# EasyEDA Pro project 无刷双驱.epro, schematic Schematic1

## Sheets
1 Control: Board Name: PCB1; Create Date: 2025-07-03; Page Name: Control; Project Name: 无刷双驱2.0; Schematic Name: Schematic1; Update Date: 2025-07-03; Company: 嘉立创EDA; Page Size: A4; Version: V1.0
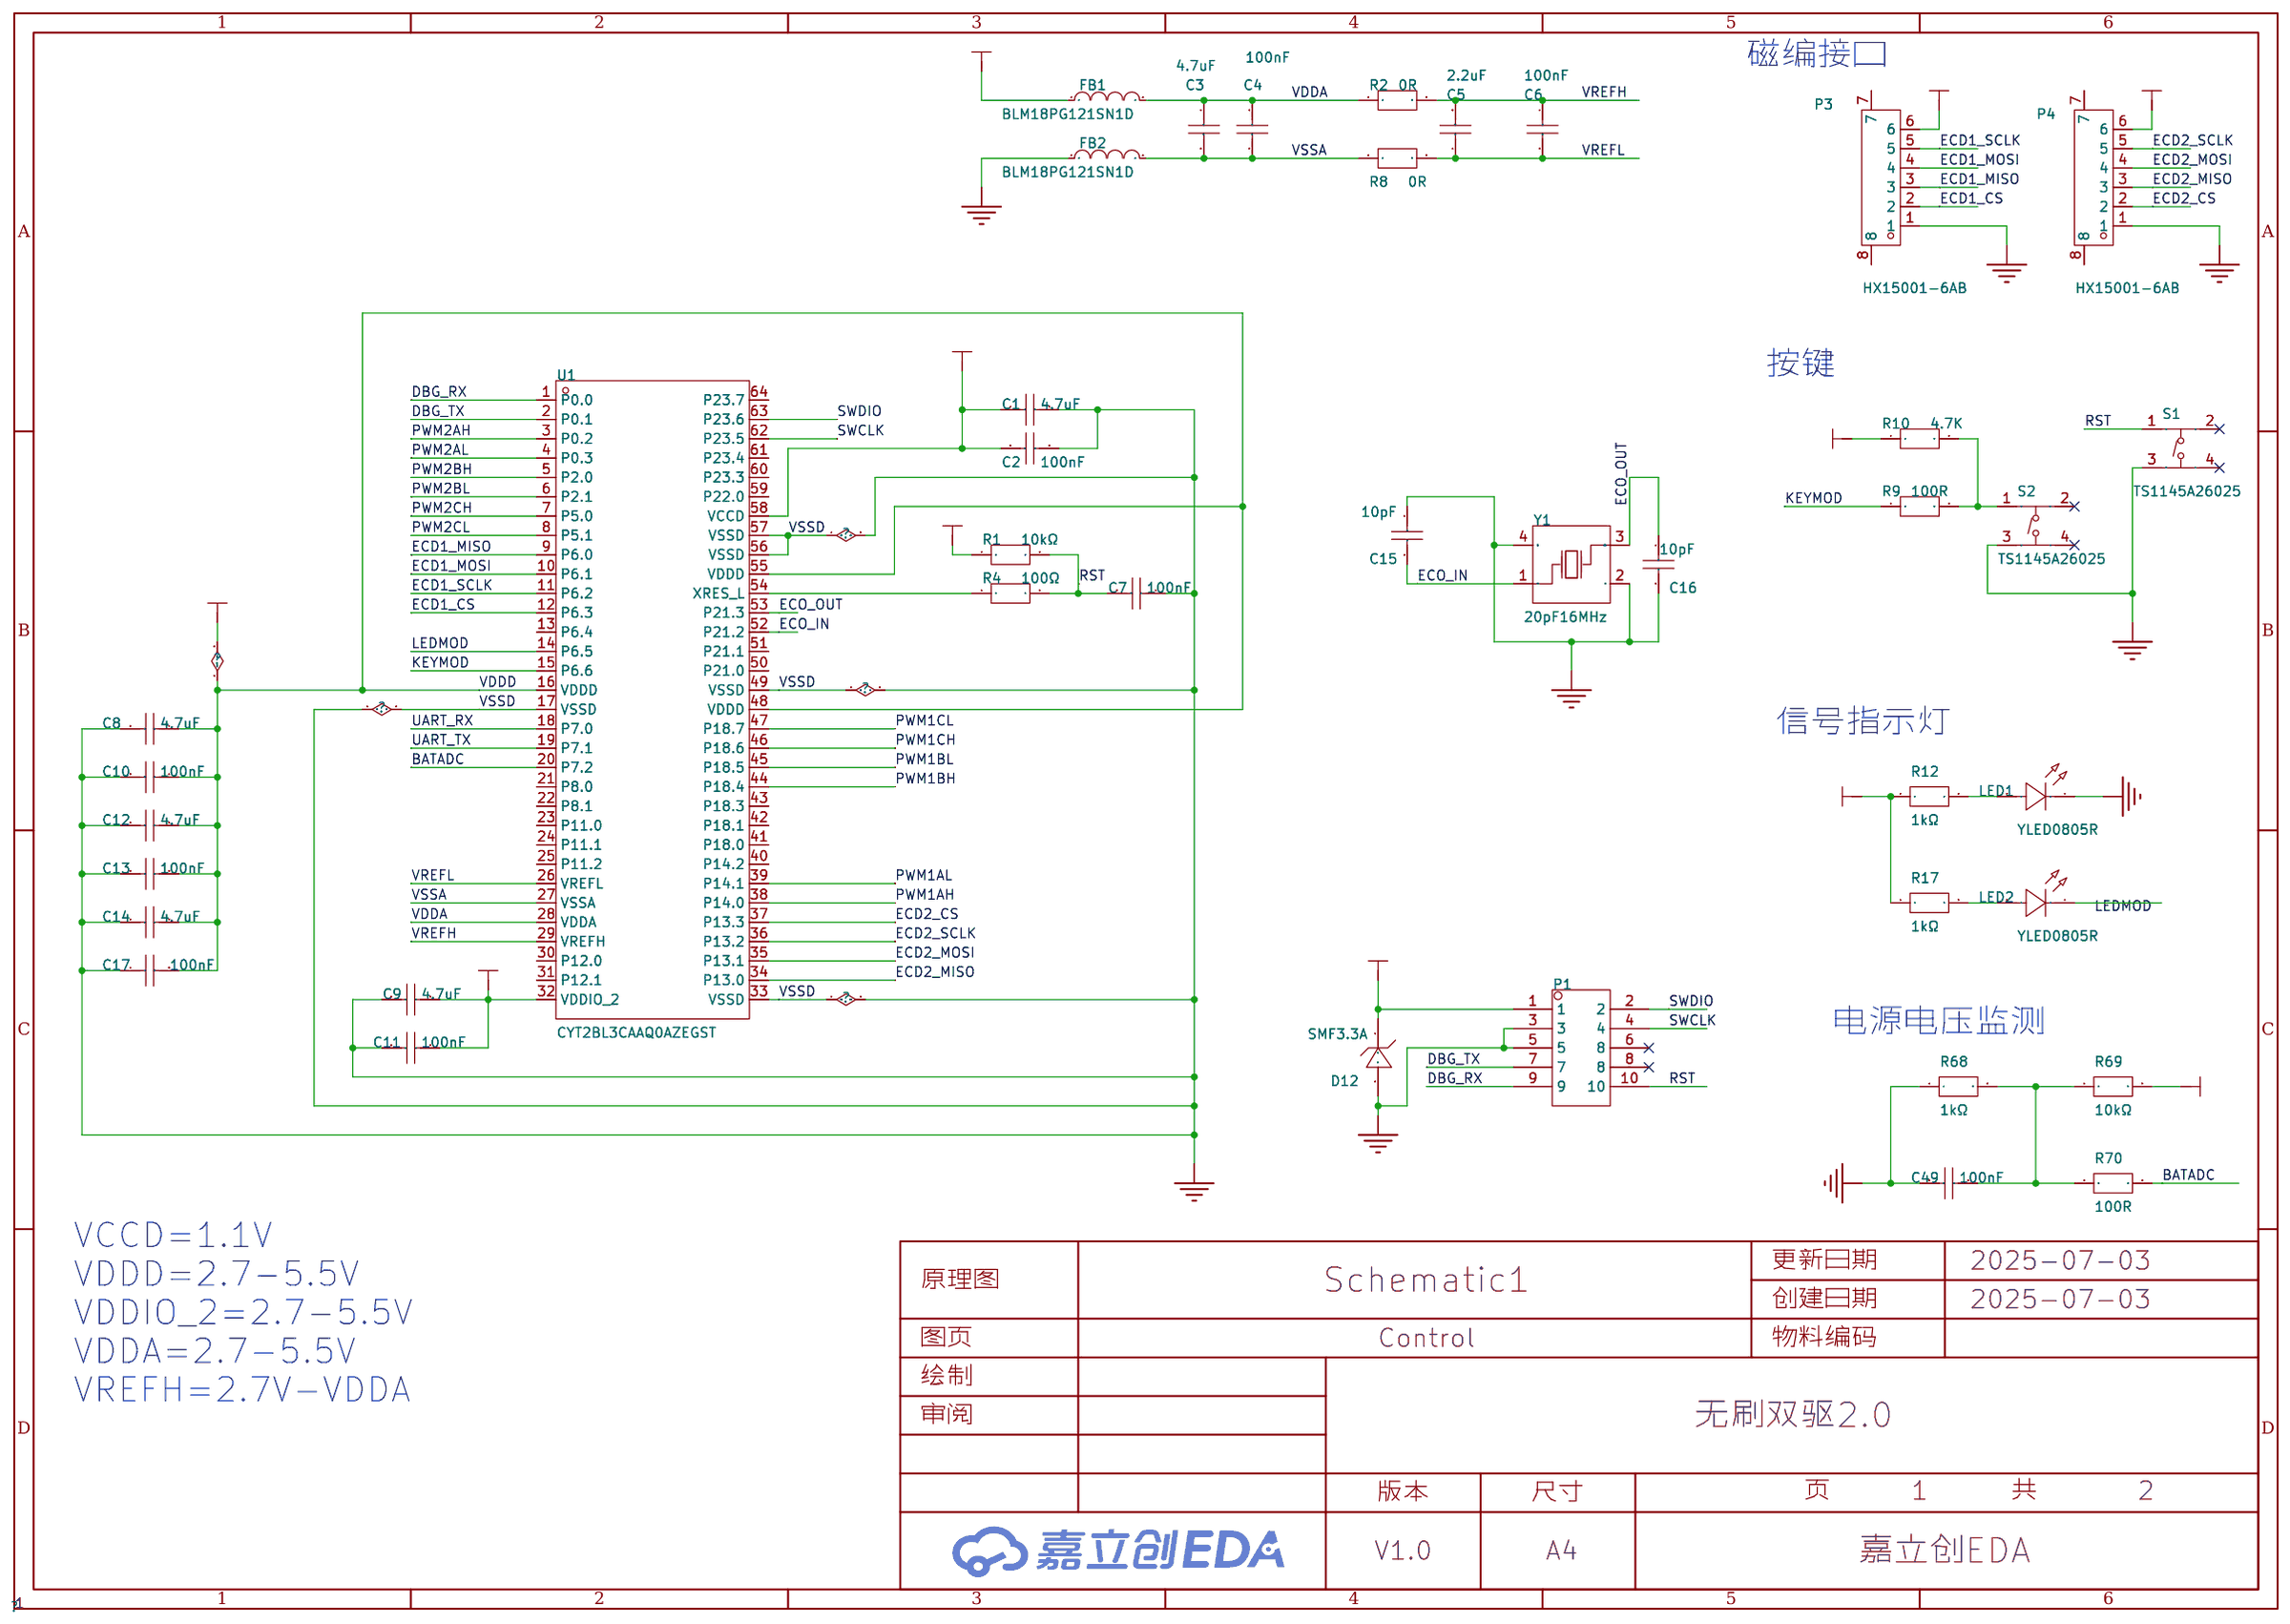
[diagram p0: Control]
2 Power: Page Name: Power; Project Name: FOC
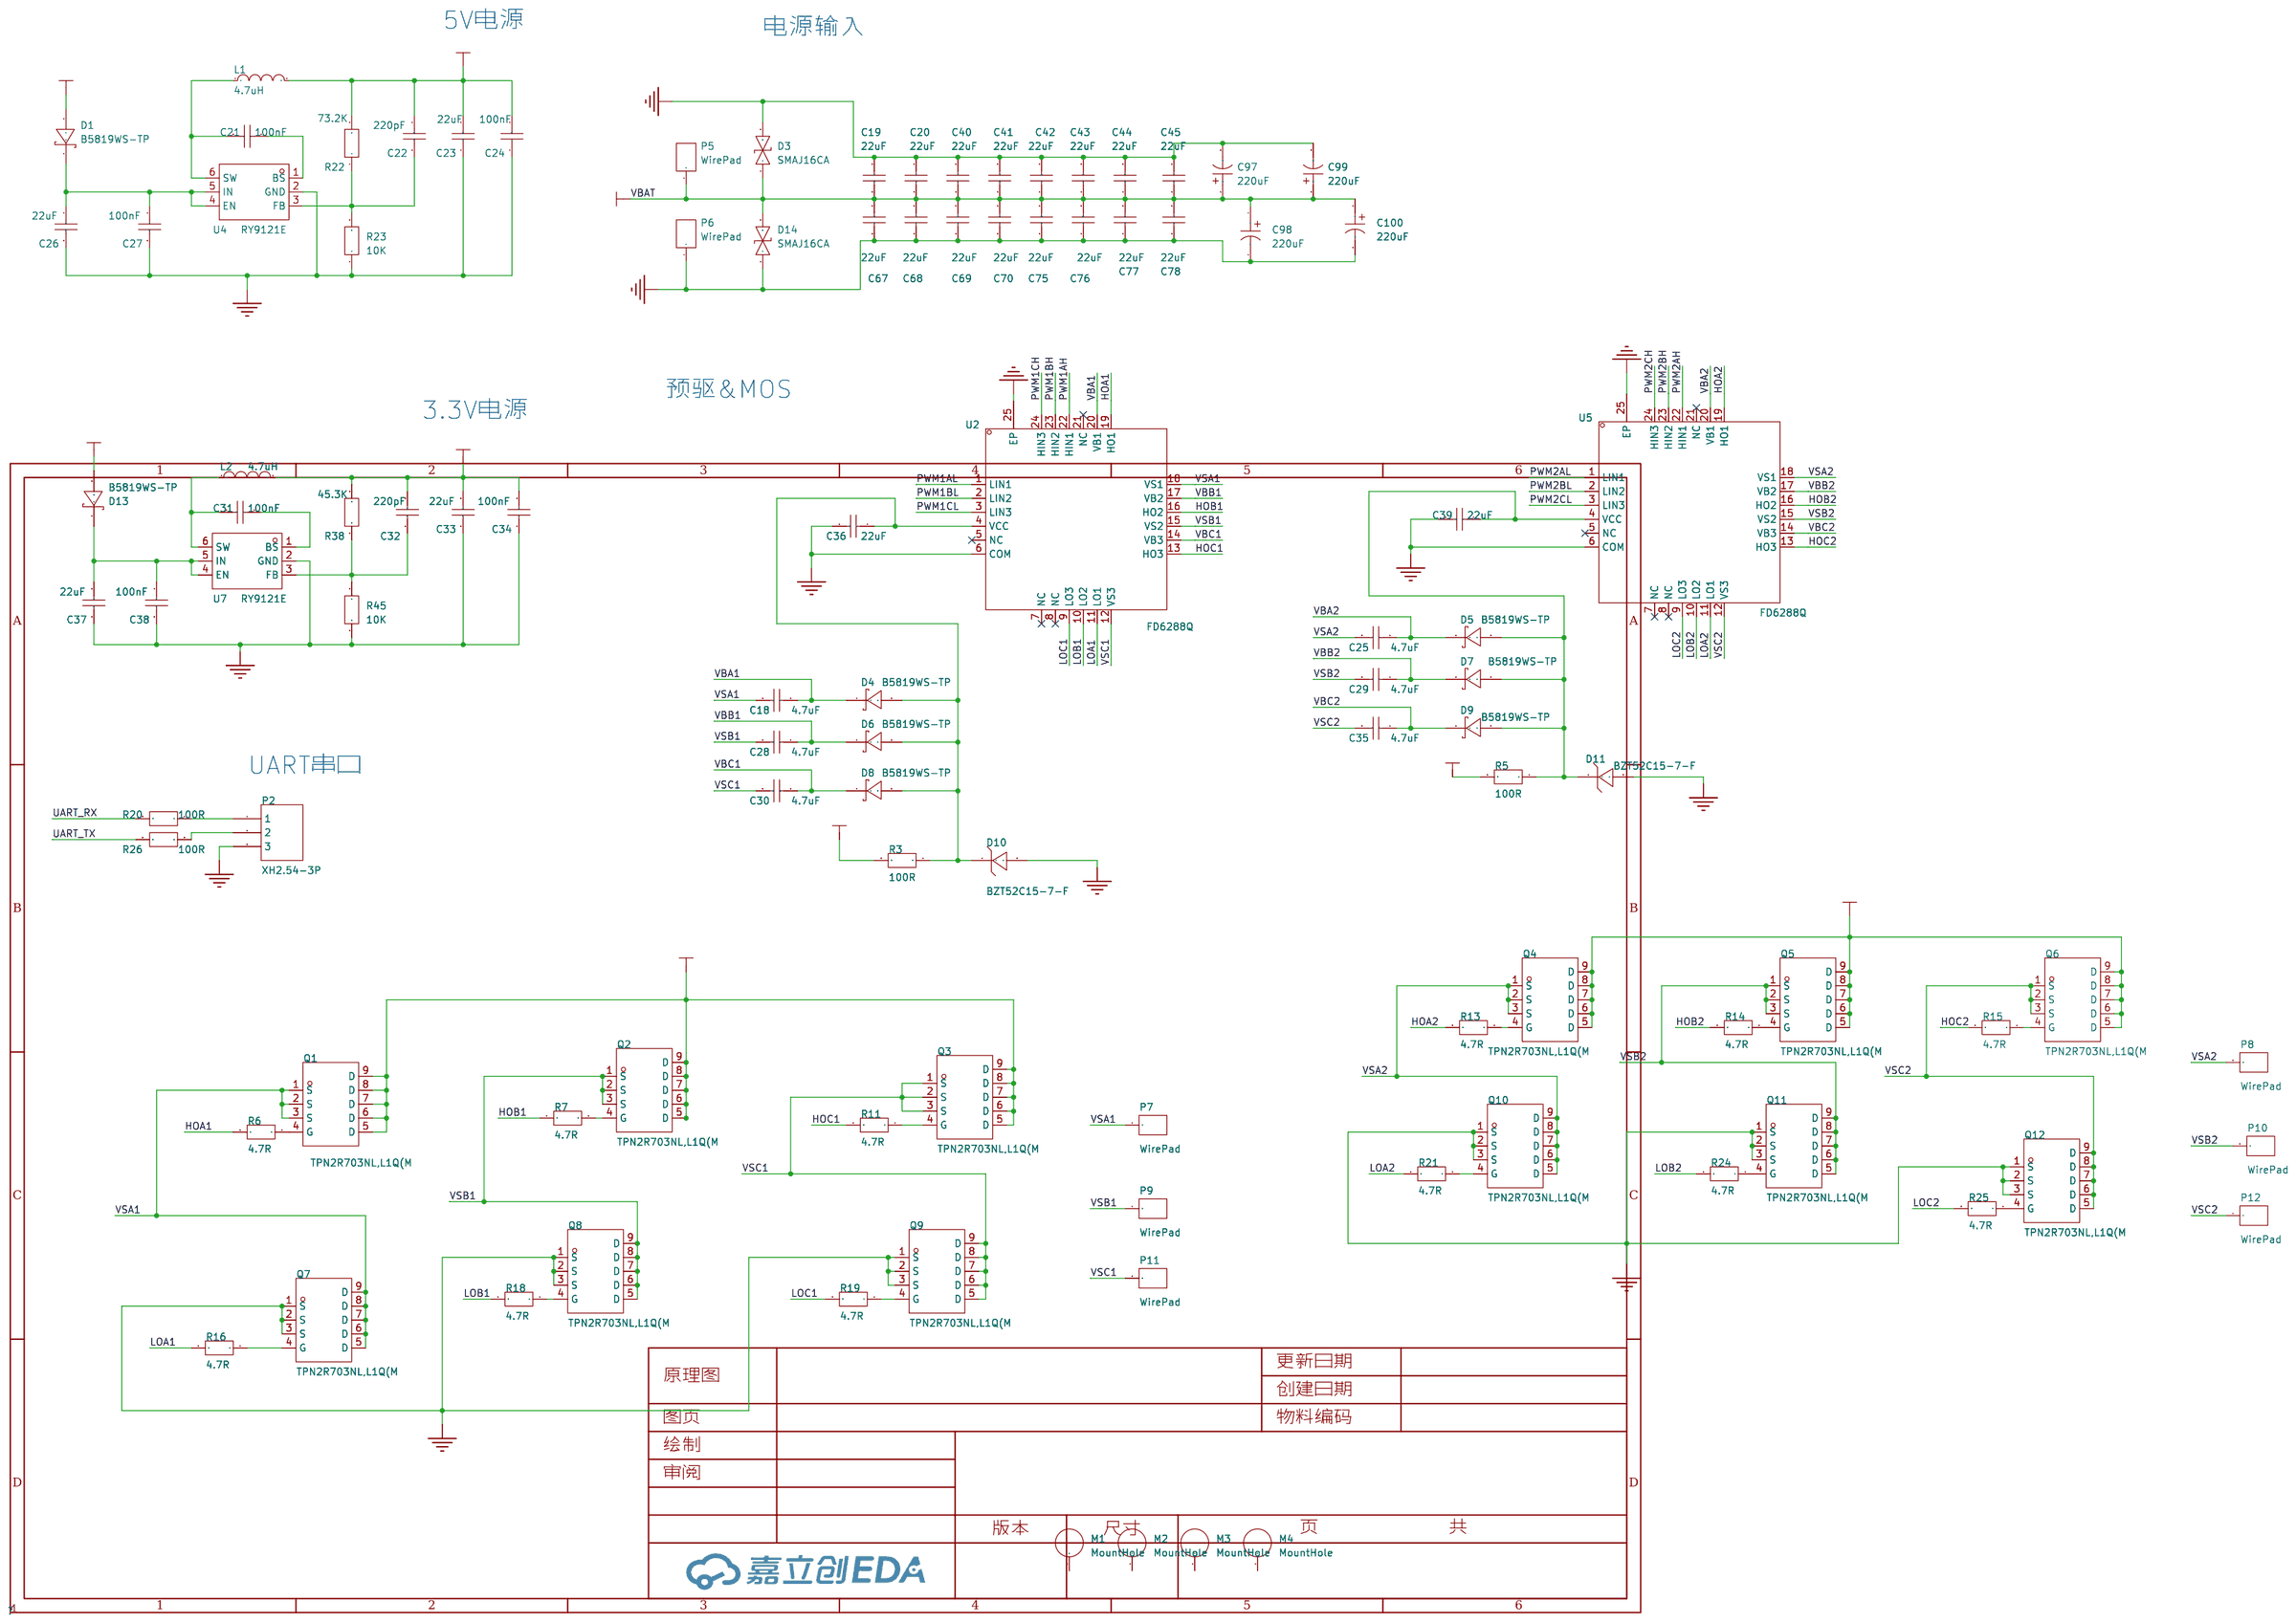
[diagram p1: Power]

## Parts
sheet Control
C1  4.7uF  [C0603]
C2  100nF  [C0603]
C3  4.7uF  [C0603]
C4  100nF  [C0603]
C5  2.2uF  [C0603]
C6  100nF  [C0603]
C7  100nF  [C0603]
C8  4.7uF  [C0603]
C9  4.7uF  [C0603]
C10  100nF  [C0603]
C11  100nF  [C0603]
C12  4.7uF  [C0603]
C13  100nF  [C0603]
C14  4.7uF  [C0603]
C15  10pF  [C0603]
C16  10pF  [C0603]
C17  100nF  [C0603]
C49  100nF  [C0603]
D12  SMF3.3A  [SOD-123_L2.8-W1.8-LS3.7-RD]
FB1  BLM18PG121SN1D  [L0603]
FB2  BLM18PG121SN1D  [L0603]
LED1  YLED0805R  [LED0805-RD]
LED2  YLED0805R  [LED0805-RD]
P1  -  [HDR-M-2.54-2x5-DS]
P3  HX15001-6AB  [CONN-SMD_HX15001-6AB]
P4  HX15001-6AB  [CONN-SMD_HX15001-6AB]
R1  10kΩ  [R0603]
R2  0R  [R0603]
R4  100Ω  [R0603]
R8  0R  [R0603]
R9  100R  [R0603]
R10  4.7K  [R0603]
R12  1kΩ  [R0603]
R17  1kΩ  [R0603]
R68  1kΩ  [R0603]
R69  10kΩ  [R0603]
R70  100R  [R0603]
S1  TS1145A26025  [SW-SMD_4P-L4.2-W3.2-P2.15-LS4.6]
S2  TS1145A26025  [SW-SMD_4P-L4.2-W3.2-P2.15-LS4.6]
U1  CYT2BL3CAAQ0AZEGST  [LQFP-64_L10.0-W10.0-P0.50-LS12.0-BL]
Y1  20pF16MHz  [CRYSTAL-SMD_4P-L3.2-W2.5-BL]
sheet Power
C18  4.7uF  [C0603]
C19  22uF  [C0603]
C20  22uF  [C0603]
C21  100nF  [C0603]
C22  220pF  [C0603]
C23  22uF  [C0603]
C24  100nF  [C0603]
C25  4.7uF  [C0603]
C26  22uF  [C0603]
C27  100nF  [C0603]
C28  4.7uF  [C0603]
C29  4.7uF  [C0603]
C30  4.7uF  [C0603]
C31  100nF  [C0603]
C32  220pF  [C0603]
C33  22uF  [C0603]
C34  100nF  [C0603]
C35  4.7uF  [C0603]
C36  22uF  [C0603]
C37  22uF  [C0603]
C38  100nF  [C0603]
C39  22uF  [C0603]
C40  22uF  [C0603]
C41  22uF  [C0603]
C42  22uF  [C0603]
C43  22uF  [C0603]
C44  22uF  [C0603]
C45  22uF  [C0603]
C67  22uF  [C0603]
C68  22uF  [C0603]
C69  22uF  [C0603]
C70  22uF  [C0603]
C75  22uF  [C0603]
C76  22uF  [C0603]
C77  22uF  [C0603]
C78  22uF  [C0603]
C97  220uF  [CAP-TH_BD6.3-P2.50-D1.0-FD]
C98  220uF  [CAP-TH_BD6.3-P2.50-D1.0-FD]
C99  220uF  [CAP-TH_BD6.3-P2.50-D1.0-FD]
C100  220uF  [CAP-TH_BD6.3-P2.50-D1.0-FD]
D1  B5819WS-TP  [SOD-323_L1.8-W1.3-LS2.5-RD]
D3  SMAJ16CA  [SMA_L4.4-W2.6-LS5.0-BI]
D4  B5819WS-TP  [SOD-323_L1.8-W1.3-LS2.5-RD]
D5  B5819WS-TP  [SOD-323_L1.8-W1.3-LS2.5-RD]
D6  B5819WS-TP  [SOD-323_L1.8-W1.3-LS2.5-RD]
D7  B5819WS-TP  [SOD-323_L1.8-W1.3-LS2.5-RD]
D8  B5819WS-TP  [SOD-323_L1.8-W1.3-LS2.5-RD]
D9  B5819WS-TP  [SOD-323_L1.8-W1.3-LS2.5-RD]
D10  BZT52C15-7-F  [SOD-123F_L2.8-W1.8-LS3.7-RD]
D11  BZT52C15-7-F  [SOD-123F_L2.8-W1.8-LS3.7-RD]
D13  B5819WS-TP  [SOD-323_L1.8-W1.3-LS2.5-RD]
D14  SMAJ16CA  [SMA_L4.4-W2.6-LS5.0-BI]
L1  4.7uH  [IND-SMD_L2.5-W2.0_YXMBL252010P]
L2  4.7uH  [IND-SMD_L2.5-W2.0_YXMBL252010P]
M1  MountHole  [M3-MountHole-Plated]
M2  MountHole  [M3-MountHole-Plated]
M3  MountHole  [M3-MountHole-Plated]
M4  MountHole  [M3-MountHole-Plated]
P2  XH2.54-3P  [XH2.54-3P-SH]
P5  WirePad  [WirePad-4x6]
P6  WirePad  [WirePad-4x6]
P7  WirePad  [WirePad-4x6]
P8  WirePad  [WirePad-4x6]
P9  WirePad  [WirePad-4x6]
P10  WirePad  [WirePad-4x6]
P11  WirePad  [WirePad-4x6]
P12  WirePad  [WirePad-4x6]
Q1  TPN2R703NL,L1Q(M  [TSON-8_L3.1-W3.1-P0.65-LS3.3-BL-EP]
Q2  TPN2R703NL,L1Q(M  [TSON-8_L3.1-W3.1-P0.65-LS3.3-BL-EP]
Q3  TPN2R703NL,L1Q(M  [TSON-8_L3.1-W3.1-P0.65-LS3.3-BL-EP]
Q4  TPN2R703NL,L1Q(M  [TSON-8_L3.1-W3.1-P0.65-LS3.3-BL-EP]
Q5  TPN2R703NL,L1Q(M  [TSON-8_L3.1-W3.1-P0.65-LS3.3-BL-EP]
Q6  TPN2R703NL,L1Q(M  [TSON-8_L3.1-W3.1-P0.65-LS3.3-BL-EP]
Q7  TPN2R703NL,L1Q(M  [TSON-8_L3.1-W3.1-P0.65-LS3.3-BL-EP]
Q8  TPN2R703NL,L1Q(M  [TSON-8_L3.1-W3.1-P0.65-LS3.3-BL-EP]
Q9  TPN2R703NL,L1Q(M  [TSON-8_L3.1-W3.1-P0.65-LS3.3-BL-EP]
Q10  TPN2R703NL,L1Q(M  [TSON-8_L3.1-W3.1-P0.65-LS3.3-BL-EP]
Q11  TPN2R703NL,L1Q(M  [TSON-8_L3.1-W3.1-P0.65-LS3.3-BL-EP]
Q12  TPN2R703NL,L1Q(M  [TSON-8_L3.1-W3.1-P0.65-LS3.3-BL-EP]
R3  100R  [R0603]
R5  100R  [R0603]
R6  4.7R  [R0603]
R7  4.7R  [R0603]
R11  4.7R  [R0603]
R13  4.7R  [R0603]
R14  4.7R  [R0603]
R15  4.7R  [R0603]
R16  4.7R  [R0603]
R18  4.7R  [R0603]
R19  4.7R  [R0603]
R20  100R  [R0603]
R21  4.7R  [R0603]
R22  73.2K  [R0603]
R23  10K  [R0603]
R24  4.7R  [R0603]
R25  4.7R  [R0603]
R26  100R  [R0603]
R38  45.3K  [R0603]
R45  10K  [R0603]
U2  FD6288Q  [QFN-24_L4.0-W4.0-P0.50-BL-EP2.6]
U4  RY9121E  [SOT-23-6_L2.9-W1.6-P0.95-LS2.8-BL]
U5  FD6288Q  [QFN-24_L4.0-W4.0-P0.50-BL-EP2.6]
U7  RY9121E  [SOT-23-6_L2.9-W1.6-P0.95-LS2.8-BL]

## Library data of the parts
C1-C45 C49 C67-C70 C75-C78 = CL10A475KO8NNNC: 容值:4.7uF;精度:±10%;额定电压:16V;材质(温度系数):X5R;; LCSC Part Name: 4.7uF ±10% 16V; Supplier Part: C19666; Manufacturer: SAMSUNG(三星); Supplier Footprint: 0603; JLCPCB Part Class: 基础库; Datasheet: https://atta.szlcsc.com/upload/public/pdf/source/20160218/1457707763339.pdf; Supplier: LCSC; Tolerance: ±10%; Voltage Rated: 16V; Temperature Coefficient: X5R
D12 = SMF3.3A_C283866: 反向截止电压(Vrwm):3.3V;最大钳位电压:8V;峰值脉冲电流(Ipp)@10/1000us:25A;击穿电压:5.2V;; Supplier Part: C283866; Manufacturer: DOWO(东沃); Supplier Footprint: SOD-123FL; JLCPCB Part Class: 扩展库; Datasheet: https://atta.szlcsc.com/upload/public/pdf/source/20240321/1BA336232F2D97E4B026619682DB80D3.pdf; Supplier: LCSC; Reverse Stand-Off Voltage (Vrwm): 3.3V; Maximum Clamping Voltage: 8V; Peak Pulse Current (Ipp)@10/1000us: 25A; Breakdown Voltage: 5.2V; Reverse Leakage Current (Ir): 600uA; Type: TVS
FB1 FB2 = BLM18PG121SN1D: 标称阻抗@测试频率:120Ω@100MHz;误差:±25%;直流电阻(RDC):50mΩ;; LCSC Part Name: 单路 0603磁珠 阻抗120Ω@100MHz; Supplier Part: C14709; Manufacturer: muRata(村田); Supplier Footprint: 0603; JLCPCB Part Class: 扩展库; Datasheet: https://atta.szlcsc.com/upload/public/pdf/source/20130704/1457706621422.pdf; Supplier: LCSC; Impedance @ Frequency: 120Ω@100MHz; Tolerance: ±25%; DC Resistance: 50mΩ; Current Rating: 2A; Circuits: 1
LED1 LED2 = YLED0805R: 发光颜色:红色;正向电压(VF):1.8V~2.4V;功率:60mW;正向电流:20mA;主波长:615nm~630nm;二极管配置:-;透镜颜色:-;色温:-;发光强度:-;发光角度:-;载带方式:-;工作温度:-40℃~+85℃;; Supplier Part: C19171391; Manufacturer: YONGYUTAI(永裕泰); Supplier Footprint: 0805; JLCPCB Part Class: 扩展库; Datasheet: https://atta.szlcsc.com/upload/public/pdf/source/20231027/AB486D22E6D71BC59190C48A798367E6.pdf; Supplier: LCSC; Emitted Color: 红色; Forward Voltage (VF): 1.8V~2.4V; Power Dissipation: 60mW; Forward Current: 20mA; Dominant Wavelength: 615nm~630nm; Peak Wavelength: 645nm; Operating Temperature: -40℃~+85℃
P1 = hdr-m-2.54-2x5-ds: 插脚排针用于夹板贴片使用，2x5，间距2.54mm
P3 P4 = HX15001-6AB: 插针结构:1x6P;间距:1.5mm;安装方式:立贴;参考系列:-;总PIN数:6P;排数:1;每排PIN数:6;行距:-;额定电流:1A;工作温度范围:-25℃~+85℃;; LCSC Part Name: 1x6P 间距:1.5mm 立贴 配套：HX15000-6Y; Supplier Part: C442142; Manufacturer: HX(红星); Supplier Footprint: SMD,P=1.5mm; JLCPCB Part Class: 扩展库; Datasheet: https://atta.szlcsc.com/upload/public/pdf/source/20200415/C442142_C06F0DDFBB95EC3947D2DC5802394DE5.pdf; Supplier: LCSC; Pins Structure: 1x6P; Pitch: 1.5mm; Mounting Style: 立贴; Number of Pins: 6P; Number of Rows: 1; Number of PINs Per Row: 6; Current Rating (Max): 1A; Operating Temperature Range: -25℃~+85℃
R1-R26 R38 R45 R68-R70 = FRC0603J103TS: 电阻类型:厚膜电阻;阻值:10kΩ;精度:±5%;功率:100mW;最大工作电压:75V;温度系数:±100ppm/℃;; LCSC Part Name: 10kΩ ±5% 100mW 厚膜电阻; Supplier Part: C2930027; Manufacturer: FOJAN(富捷); Supplier Footprint: 0603; JLCPCB Part Class: 扩展库; Datasheet: https://atta.szlcsc.com/upload/public/pdf/source/20211221/925EC7D7225764EE0046F22065062C87.pdf; Supplier: LCSC; Type: 厚膜电阻; Tolerance: ±5%; Power(Watts): 100mW; Overload Voltage (Max): 75V; Temperature Coefficient: ±100ppm/℃; Operating Temperature Range: -55℃~+155℃
S1 S2 = TS1145A26025: Supplier Part: C22375315; Manufacturer: HanElectricity(瀚源); Supplier Footprint: SMD-4P,4.2x3.2mm; JLCPCB Part Class: 扩展库; Datasheet: https://atta.szlcsc.com/upload/public/pdf/source/20240426/BE19A9ACDD8195A867E04CF99141E744.pdf; Supplier: LCSC
U1 = CYT2BL3CAAQ0AZEGST: CPU内核:ARM-M4；ARM-M0+;CPU最大主频:100MHz；160MHz;应用领域:-;; Supplier Part: C6814187; Manufacturer: Infineon(英飞凌); Supplier Footprint: LQFP-64(10x10); JLCPCB Part Class: Extended Part; Datasheet: https://atta.szlcsc.com/upload/public/pdf/source/20241028/9C5F45A22757023D6821BF2A2597B3D9.pdf; Supplier: LCSC; CPU Core: ARM-M4；ARM-M0+; CPU Maximum Speed: 100MHz；160MHz; Number of I/O: 49; ADC (Bit): 12bit; Low Voltage Detection Threshold: 2.7V~5.5V
Y1 = TAXM16M4RLBCCT2T: 晶振类型:贴片晶振;频率:16MHz;常温频差:±10ppm;负载电容:20pF;频率稳定度(全温):±15ppm;; LCSC Part Name: 16MHz ±10ppm 20pF; Supplier Part: C164049; Manufacturer: YJX(雅晶鑫); Supplier Footprint: SMD3225-4P; JLCPCB Part Class: 扩展库; Datasheet: https://atta.szlcsc.com/upload/public/pdf/source/20200713/C164049_7D9D040C2FDFEE55E99A1CB38C95A19D.pdf; Supplier: LCSC; Crystal Type: 贴片晶振; Normal temperature Frequency Tolerance: ±10ppm; Load Capacitor: 20pF; Frequency Stability(Full temperature range): ±15ppm; Equivalent Series Resistance (ESR): 40Ω; Operating Temperature: -40℃~+85℃
C97-C100 = 25YXJ220M6.3X11: 容值:220uF;精度:±20%;额定电压:25V;纹波电流:400mA@100kHz;等效串联电阻:220mΩ@100kHz;; LCSC Part Name: 220uF ±20% 25V; Supplier Part: C88729; Manufacturer: rubycon(红宝石); Supplier Footprint: 插件,D6.3xL11mm; JLCPCB Part Class: Extended Part; Datasheet: https://atta.szlcsc.com/upload/public/pdf/source/20190927/C432444_D90212164DBC1B856ABE912664018FD4.pdf; Supplier: LCSC; Tolerance: ±20%; Rated Voltage: 25V; Ripple Current: 400mA@100kHz; Equivalent Series Resistance(ESR): 220mΩ@100kHz; Lead Spacing: 2.5mm; φD: 6.3mm; L: 11mm; Lifetime @ Temp: 7000hrs@105℃
D1 D4-D9 D13 = B5819WS-TP: 正向压降(Vf):600mV@1A;直流反向耐压(Vr):40V;平均整流电流(Io):1A;; LCSC Part Name: 电压:40V 电流:1A; Supplier Part: C78734; Manufacturer: MCC(美微科); Supplier Footprint: SOD-323; JLCPCB Part Class: 扩展库; Datasheet: https://atta.szlcsc.com/upload/public/pdf/source/20190308/C78734_7BD7F562D63F05C7B4187010ADA330AA.pdf; Supplier: LCSC; Forward Voltage (Vf@If): 600mV@1A; Reverse Voltage (Vr): 40V; Average Rectified Current (Io): 1A; Reverse Leakage Current (Ir): 1mA@40V
D3 D14 = SMAJ16CA_C148217: 反向截止电压(Vrwm):16V;最大钳位电压:26V;峰值脉冲电流(Ipp)@10/1000us:15.4A;峰值脉冲功率(Ppp)@10/1000us:400W;击穿电压:17.8V;; LCSC Part Name: 双向TVS 16V截止 15.4A峰值脉冲; Supplier Part: C148217; Manufacturer: Littelfuse(美国力特); Supplier Footprint: SMA(DO-214AC); JLCPCB Part Class: 扩展库; Datasheet: https://atta.szlcsc.com/upload/public/pdf/source/20190402/C374025_5ACE77BC72947DF13CF0CBC7F8B57228.pdf; Supplier: LCSC; Reverse Stand-Off Voltage (Vrwm): 16V; Maximum Clamping Voltage: 26V; Peak Pulse Current (Ipp)@10/1000us: 15.4A; Peak Pulse Power Dissipation (Ppp)@10/1000us: 400W; Breakdown Voltage: 17.8V; Type: TVS
D10 D11 = BZT52C15-7-F: 二极管配置:独立式;稳压值(标称值):15V;稳压值(范围):13.8V~15.6V;功率(Pd):500mW;; Supplier Part: C177014; Manufacturer: DIODES(美台); Supplier Footprint: SOD-123; JLCPCB Part Class: 扩展库; Datasheet: https://atta.szlcsc.com/upload/public/pdf/source/20190711/C397931_3C6B91801DE45802E2D186F3C264AC27.pdf; Supplier: LCSC; Diode Configuration: 独立式; Zener Voltage (Nom): 15V; Reverse Leakage Current (Ir): 100nA@10.5V; Zener Voltage (Range): 13.8V~15.6V; Power Dissipation: 500mW; Zener Impedance (Zzt): 30Ω
L1 L2 = APH252010T4R7M: 电感值:4.7uH;精度:±20%;额定电流:1.6A;饱和电流(Isat):2A;类型:一体成型电感;; LCSC Part Name: 4.7uH ±20% 2A; Supplier Part: C5349608; Manufacturer: APV(爱普微); Supplier Footprint: 1008; JLCPCB Part Class: 扩展库; Datasheet: https://atta.szlcsc.com/upload/public/pdf/source/20240422/625E1A31A240F2D65C1915745A2472C0.pdf; Supplier: LCSC; Tolerance: ±20%; Rated Current: 1.6A; Saturation Current (Isat): 2A; DC Resistance (DCR): 160mΩ; Type: 一体成型电感
M1-M4 = MountHole: Origin Footprint 2: M3-MountHole; Origin Footprint 3: M3-MountSlot; Origin Footprint 4: M3-MountSlot-Plated; Origin Footprint 5: M3-MountHole-4mm; Origin Footprint 6: M3-MountHole-5mm; Origin Footprint 7: M3-MountHole-6mm; Origin Footprint 8: M3-MountHole-7mm; Origin Footprint 9: M3-MountHole-8mm; Origin Footprint 10: M3-MountHole-9mm; Origin Footprint 11: M3-MountHole-10mm; Origin Footprint 12: M3-MountHole-11mm; Origin Footprint 13: M3-MountHole-12mm; Origin Footprint 14: M3-MountHole-13mm; Origin Footprint 15: M3-MountHole-14mm; Origin Footprint 16: M3-MountHole-15mm; Origin Footprint 17: M3-MountHole-16mm; Origin Footprint 18: M3-MountHole-17mm; Origin Footprint 19: M3-MountHole-18mm; Origin Footprint 20: M3-MountHole-19mm; Origin Footprint 21: M3-MountHole-20mm; Origin Footprint 22: M3-MountHole-Plated-4MM; Origin Footprint 23: M3-MountHole-Plated-5MM; Origin Footprint 24: M3-MountHole-Plated-6MM; Origin Footprint 25: M3-MountHole-Plated-7MM; Origin Footprint 26: M3-MountHole-Plated-8MM; Origin Footprint 27: M3-MountHole-Plated-9MM; Origin Footprint 28: M3-MountHole-Plated-10MM; Origin Footprint 29: M3-MountHole-Plated-11MM; Origin Footprint 30: M3-MountHole-Plated-12MM; Origin Footprint 31: M3-MountHole-Plated-13MM; Origin Footprint 32: M3-MountHole-Plated-14MM; Origin Footprint 33: M3-MountHole-Plated-15MM; Origin Footprint 34: M3-MountHole-Plated-16MM; Origin Footprint 35: M3-MountHole-Plated-17MM; Origin Footprint 36: M3-MountHole-Plated-18MM; Origin Footprint 37: M3-MountHole-Plated-19MM; Origin Footprint 38: M3-MountHole-Plated-20MM
P2 = XH2.54-3P: Revision: V1.0; Footprint Name: XH2.54-3P-DV
P5-P12 = WirePad: 线缆焊盘; Footprint Name: WirePad-4.5x7
Q1-Q12 = TPN2R703NL,L1Q(M: 类型:1个N沟道;漏源电压(Vdss):30V;连续漏极电流(Id):-;导通电阻(RDS(on)@Vgs,Id):3.3mΩ@4.5V,22.5A;功率:42W;阈值电压(Vgs(th)@Id):1.3V@0.3mA;; Supplier Part: C5307666; Manufacturer: TOSHIBA(东芝); Supplier Footprint: TSON-8; JLCPCB Part Class: 扩展库; Datasheet: https://atta.szlcsc.com/upload/public/pdf/source/20221207/F3F28B90115C5E074AC0CD2ED28456D7.pdf; Supplier: LCSC; Type: 1个N沟道; Drain Source Voltage (Vdss): 30V; Drain Source On Resistance (RDS(on)@Vgs,Id): 3.3mΩ@4.5V,22.5A; Power Dissipation (Pd): 42W; Gate Threshold Voltage (Vgs(th)@Id): 1.3V@0.3mA; Input Capacitance (Ciss@Vds): 1.6nF@15V; Reverse Transfer Capacitance (Crss@Vds): 53pF@15V
U2 U5 = FD6288Q: Supplier Part: C328453; Manufacturer: Fortior Tech(峰岹); Supplier Footprint: QFN-24-EP(4x4); JLCPCB Part Class: 扩展库; Datasheet: https://atta.szlcsc.com/upload/public/pdf/source/20241101/0E2856EB301EAFFED732065FB088D773.pdf; Supplier: LCSC
U4 U7 = RY9121E: Supplier Part: C22392164; Manufacturer: RYCHiP(蕊源); Supplier Footprint: SOT-23-6; JLCPCB Part Class: 扩展库; Supplier: LCSC

## Nets
GND: C1.2 C2.2 C7.1 C8.2 C9.2 C10.2 C11.2 C12.1 C13.1 C14.1 C15.1 C16.2 C17.1 C19.2 C20.2 C23.1 C24.1 C26.2 C27.2 C33.1 C34.1 C36.2 C37.2 C38.2 C39.2 C40.2 C41.2 C42.2 C43.2 C44.2 C45.2 C49.1 C67.1 C68.1 C69.1 C70.1 C75.1 C76.1 C77.1 C78.1 C97.2 C98.2 C99.2 C100.2 D3.2 D10.2(A) D11.2(A) D12.2 D14.1 FB2.1 LED1.1(K) P1.3 P1.5 P2.3 P3.1 P4.1 P6.1 Q7.1(S) Q7.2(S) Q7.3(S) Q8.1(S) Q8.2(S) Q8.3(S) Q9.1(S) Q9.2(S) Q9.3(S) Q10.1(S) Q10.2(S) Q10.3(S) Q11.1(S) Q11.2(S) Q11.3(S) Q12.1(S) Q12.2(S) Q12.3(S) R23.1 R45.1 R68.1 S1.3 S2.3 U1.17(VSSD) U1.33(VSSD) U1.49(VSSD) U1.56(VSSD) U1.57(VSSD) U2.6(COM) U2.25(EP) U4.2(GND) U5.6(COM) U5.25(EP) U7.2(GND) Y1.2(GND) Y1.4(GND)
VBAT: C19.1 C20.1 C40.1 C41.1 C42.1 C43.1 C44.1 C45.1 C67.2 C68.2 C69.2 C70.2 C75.2 C76.2 C77.2 C78.2 C97.1 C98.1 C99.1 C100.1 D1.2(A) D3.1 D13.2(A) D14.2 P5.1 Q1.5(D) Q1.6(D) Q1.7(D) Q1.8(D) Q1.9(D) Q2.5(D) Q2.6(D) Q2.7(D) Q2.8(D) Q2.9(D) Q3.5(D) Q3.6(D) Q3.7(D) Q3.8(D) Q3.9(D) Q4.5(D) Q4.6(D) Q4.7(D) Q4.8(D) Q4.9(D) Q5.5(D) Q5.6(D) Q5.7(D) Q5.8(D) Q5.9(D) Q6.5(D) Q6.6(D) Q6.7(D) Q6.8(D) Q6.9(D) R3.2 R5.2 R69.2
VCC1V1: C1.1 C2.1 U1.58(VCCD)
VCC3V3: C8.1 C9.1 C10.1 C11.1 C12.2 C13.2 C14.2 C17.2 C32.2 C33.2 C34.2 D12.1 FB1.1 L2.2 P1.1 R1.1 R10.1 R12.1 R17.1 R38.2 U1.16(VDDD) U1.32(VDDIO_2) U1.48(VDDD) U1.55(VDDD)
VCC5V: C22.2 C23.2 C24.2 L1.2 P3.6 P4.6 R22.2
VDDA: C3.1 C4.2 FB1.2 R2.1 U1.28(VDDA)
VSSA: C3.2 C4.1 FB2.2 R8.1 U1.27(VSSA)
BATADC: R70.2 U1.20(P7.2)
DBG_RX: P1.9 U1.1(P0.0)
DBG_TX: P1.7 U1.2(P0.1)
ECD1_CS: P3.2 U1.12(P6.3)
ECD1_MISO: P3.3 U1.9(P6.0)
ECD1_MOSI: P3.4 U1.10(P6.1)
ECD1_SCLK: P3.5 U1.11(P6.2)
ECD2_CS: P4.2 U1.37(P13.3)
ECD2_MISO: P4.3 U1.34(P13.0)
ECD2_MOSI: P4.4 U1.35(P13.1)
ECD2_SCLK: P4.5 U1.36(P13.2)
ECO_IN: C15.2 U1.52(P21.2) Y1.1(ECO_IN)
ECO_OUT: C16.1 U1.53(P21.3) Y1.3(ECO_OUT)
HOA1: R6.2 U2.19(HO1)
HOA2: R13.2 U5.19(HO1)
HOB1: R7.2 U2.16(HO2)
HOB2: R14.2 U5.16(HO2)
HOC1: R11.2 U2.13(HO3)
HOC2: R15.2 U5.13(HO3)
KEYMOD: R9.1 U1.15(P6.6)
LEDMOD: LED2.1(K) U1.14(P6.5)
LOA1: R16.2 U2.11(LO1)
LOA2: R21.2 U5.11(LO1)
LOB1: R18.2 U2.10(LO2)
LOB2: R24.2 U5.10(LO2)
LOC1: R19.2 U2.9(LO3)
LOC2: R25.2 U5.9(LO3)
PWM1AH: U1.38(P14.0) U2.22(HIN1)
PWM1AL: U1.39(P14.1) U2.1(LIN1)
PWM1BH: U1.44(P18.4) U2.23(HIN2)
PWM1BL: U1.45(P18.5) U2.2(LIN2)
PWM1CH: U1.46(P18.6) U2.24(HIN3)
PWM1CL: U1.47(P18.7) U2.3(LIN3)
PWM2AH: U1.3(P0.2) U5.22(HIN1)
PWM2AL: U1.4(P0.3) U5.1(LIN1)
PWM2BH: U1.5(P2.0) U5.23(HIN2)
PWM2BL: U1.6(P2.1) U5.2(LIN2)
PWM2CH: U1.7(P5.0) U5.24(HIN3)
PWM2CL: U1.8(P5.1) U5.3(LIN3)
RST: C7.2 P1.10 R1.2 R4.2 S1.1
SWCLK: P1.4 U1.62(P23.5)
SWDIO: P1.2 U1.63(P23.6)
UART_RX: R20.2 U1.18(P7.0)
UART_TX: R26.2 U1.19(P7.1)
VBA1: C18.1 D4.1(K) U2.20(VB1)
VBA2: C25.1 D5.1(K) U5.20(VB1)
VBB1: C28.1 D6.1(K) U2.17(VB2)
VBB2: C29.1 D7.1(K) U5.17(VB2)
VBC1: C30.1 D8.1(K) U2.14(VB3)
VBC2: C35.1 D9.1(K) U5.14(VB3)
VREFH: C5.2 C6.1 R2.2 U1.29(VREFH)
VREFL: C5.1 C6.2 R8.2 U1.26(VREFL)
VSA1: C18.2 P7.1 Q1.1(S) Q1.2(S) Q1.3(S) Q7.5(D) Q7.6(D) Q7.7(D) Q7.8(D) Q7.9(D) U2.18(VS1)
VSA2: C25.2 P8.1 Q4.1(S) Q4.2(S) Q4.3(S) Q10.5(D) Q10.6(D) Q10.7(D) Q10.8(D) Q10.9(D) U5.18(VS1)
VSB1: C28.2 P9.1 Q2.1(S) Q2.2(S) Q2.3(S) Q8.5(D) Q8.6(D) Q8.7(D) Q8.8(D) Q8.9(D) U2.15(VS2)
VSB2: C29.2 P10.1 Q5.1(S) Q5.2(S) Q5.3(S) Q11.5(D) Q11.6(D) Q11.7(D) Q11.8(D) Q11.9(D) U5.15(VS2)
VSC1: C30.2 P11.1 Q3.1(S) Q3.2(S) Q3.3(S) Q9.5(D) Q9.6(D) Q9.7(D) Q9.8(D) Q9.9(D) U2.12(VS3)
VSC2: C35.2 P12.1 Q6.1(S) Q6.2(S) Q6.3(S) Q12.5(D) Q12.6(D) Q12.7(D) Q12.8(D) Q12.9(D) U5.12(VS3)
$1N2554: R4.1 U1.54(XRES_L)
$1N4377: R9.2 R10.2 S2.1
$1N4714: LED1.2(A) R12.2
$1N4753: LED2.2(A) R17.2
$1N5000: C49.2 R68.2 R69.1 R70.1
$2N2919: C37.1 C38.1 D13.1(K) U7.4(EN) U7.5(IN)
$2N2936: C31.2 L2.1 U7.6(SW)
$2N2941: C31.1 U7.1(BS)
$2N3608: C26.1 C27.1 D1.1(K) U4.4(EN) U4.5(IN)
$2N3613: C21.2 L1.1 U4.6(SW)
$2N3618: C21.1 U4.1(BS)
$2N3786: P2.1 R20.1
$2N3825: P2.2 R26.1
$2N7405: Q4.4(G) R13.1
$2N7407: Q5.4(G) R14.1
$2N7409: Q6.4(G) R15.1
$2N7411: Q12.4(G) R25.1
$2N7413: Q11.4(G) R24.1
$2N7415: Q10.4(G) R21.1
$2N14646: Q1.4(G) R6.1
$2N14647: Q2.4(G) R7.1
$2N14648: Q3.4(G) R11.1
$2N14649: Q9.4(G) R19.1
$2N14650: Q8.4(G) R18.1
$2N14651: Q7.4(G) R16.1
$2N21955: C22.1 R22.1 R23.2 U4.3(FB)
$2N22020: C32.1 R38.1 R45.2 U7.3(FB)
$2N29420: C36.1 D4.2(A) D6.2(A) D8.2(A) D10.1(K) R3.1 U2.4(VCC)
$2N29442: C39.1 D5.2(A) D7.2(A) D9.2(A) D11.1(K) R5.1 U5.4(VCC)

Not connected (* = marked no-connect by the designer): M1 1; M2 1; M3 1; M4 1; P1 6(8)* 8*; P3 7 8; P4 7 8; S1 2* 4*; S2 2* 4*; U1 13(P6.4) 21(P8.0) 22(P8.1) 23(P11.0) 24(P11.1) 25(P11.2) 30(P12.0) 31(P12.1) 40(P14.2) 41(P18.0) 42(P18.1) 43(P18.3) 50(P21.0) 51(P21.1) 59(P22.0) 60(P23.3) 61(P23.4) 64(P23.7); U2 5(NC)* 7(NC)* 8(NC)* 21(NC)*; U5 5(NC)* 7(NC)* 8(NC)* 21(NC)*

## Notes on the sheets
sheet 1
- 磁编接口
- 按键
- 信号指示灯
- 电源电压监测
- VCCD=1.1V
  VDDD=2.7-5.5V
  VDDIO_2=2.7-5.5V
  VDDA=2.7-5.5V
  VREFH=2.7V-VDDA
sheet 2
- 5V电源
- 电源输入
- 预驱&MOS
- 3.3V电源
- UART串口
